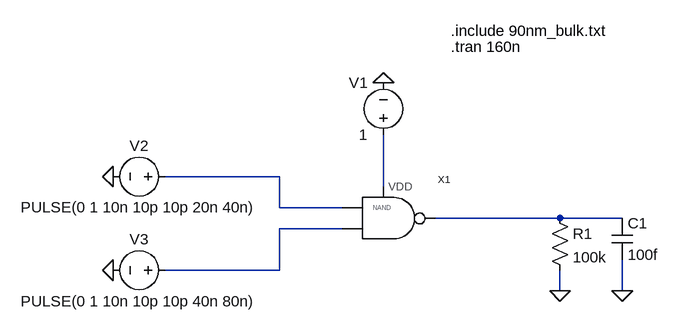
[diagram p0: schematic Draft2.asc]
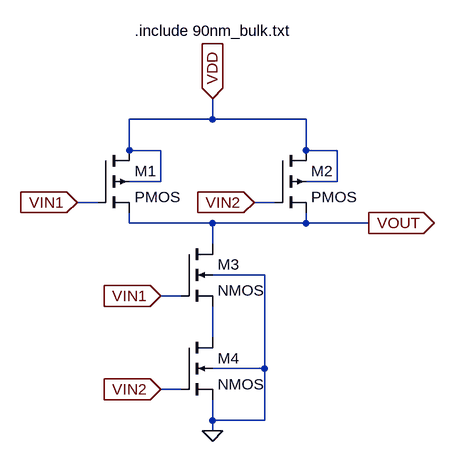
[diagram p1: sub-circuit nand_2.asc]
Draft2.asc, the LTspice schematic file:
Version 4
SHEET 1 880 680
WIRE 224 160 48 160
WIRE 384 176 384 96
WIRE 224 208 224 160
WIRE 320 208 224 208
WIRE 656 224 464 224
WIRE 752 224 656 224
WIRE 320 240 224 240
WIRE 224 304 224 240
WIRE 224 304 48 304
WIRE 656 336 656 304
WIRE 752 336 752 288
FLAG -32 160 0
FLAG -32 304 0
FLAG 656 336 0
FLAG 752 336 0
FLAG 384 16 0
SYMBOL voltage 384 112 R180
WINDOW 0 24 96 Left 2
WINDOW 3 24 16 Left 2
WINDOW 123 0 0 Left 0
WINDOW 39 0 0 Left 0
SYMATTR InstName V1
SYMATTR Value 1
SYMBOL voltage 64 160 R90
WINDOW 0 -32 56 VBottom 2
WINDOW 3 32 56 VTop 2
WINDOW 123 0 0 Left 0
WINDOW 39 0 0 Left 0
SYMATTR InstName V2
SYMATTR Value PULSE(0 1 10n 10p 10p 20n 40n)
SYMBOL voltage 64 304 R90
WINDOW 0 -32 56 VBottom 2
WINDOW 3 32 56 VTop 2
WINDOW 123 0 0 Left 0
WINDOW 39 0 0 Left 0
SYMATTR InstName V3
SYMATTR Value PULSE(0 1 10n 10p 10p 40n 80n)
SYMBOL res 640 208 R0
SYMATTR InstName R1
SYMATTR Value 100k
SYMBOL cap 736 224 R0
SYMATTR InstName C1
SYMATTR Value 100f
SYMBOL nand_2 384 224 R0
SYMATTR InstName X1
TEXT 488 -64 Left 2 !.include 90nm_bulk.txt
TEXT 488 -40 Left 2 !.tran 160n

nand_2.asc, the sub-circuit schematic file:
Version 4
SHEET 1 1884 788
WIRE 256 -16 256 -48
WIRE 256 -16 128 -16
WIRE 400 -16 256 -16
WIRE 128 32 128 -16
WIRE 176 32 128 32
WIRE 400 32 400 -16
WIRE 448 32 400 32
WIRE 176 80 176 32
WIRE 176 80 128 80
WIRE 448 80 448 32
WIRE 448 80 400 80
WIRE 80 112 48 112
WIRE 352 112 320 112
WIRE 128 144 128 128
WIRE 256 144 128 144
WIRE 400 144 400 128
WIRE 400 144 256 144
WIRE 496 144 400 144
WIRE 256 176 256 144
WIRE 336 224 256 224
WIRE 208 256 176 256
WIRE 256 320 256 272
WIRE 336 368 336 224
WIRE 336 368 256 368
WIRE 208 400 176 400
WIRE 256 448 256 416
WIRE 336 448 336 368
WIRE 336 448 256 448
WIRE 256 464 256 448
FLAG 48 112 VIN1
IOPIN 48 112 In
FLAG 320 112 VIN2
IOPIN 320 112 In
FLAG 256 -48 VDD
IOPIN 256 -48 In
FLAG 496 144 VOUT
IOPIN 496 144 Out
FLAG 176 256 VIN1
IOPIN 176 256 In
FLAG 176 400 VIN2
IOPIN 176 400 In
FLAG 256 464 0
SYMBOL nmos4 208 176 R0
SYMATTR InstName M3
SYMATTR Value2 l=90n w=200n
SYMBOL pmos4 80 32 R0
SYMATTR InstName M1
SYMATTR Value2 l=90n w=400n
SYMBOL pmos4 352 32 R0
SYMATTR InstName M2
SYMATTR Value2 l=90n w=400n
SYMBOL nmos4 208 320 R0
SYMATTR InstName M4
SYMATTR Value2 l=90n w=200n
TEXT 136 -152 Left 2 !.include 90nm_bulk.txt

The netlist it stands for:
* Draft2.asc
V1 N002 0 1
V2 N001 0 PULSE(0 1 10n 10p 10p 20n 40n)
V3 N004 0 PULSE(0 1 10n 10p 10p 40n 80n)
R1 N003 0 100k
C1 N003 0 100f
XX1 N001 N004 N002 N003 nand_2

* block symbol definitions
.subckt nand_2 VIN1 VIN2 VDD VOUT
M3 VOUT VIN1 N001 0 NMOS l=90n w=200n
M1 VDD VIN1 VOUT VDD PMOS l=90n w=400n
M2 VDD VIN2 VOUT VDD PMOS l=90n w=400n
M4 N001 VIN2 0 0 NMOS l=90n w=200n
.include 90nm_bulk.txt
.ends nand_2

.model NMOS NMOS
.model PMOS PMOS
.lib standard.mos
.include 90nm_bulk.txt
.tran 160n
.backanno
.end